# Altium project W5500-2.PrjPcb
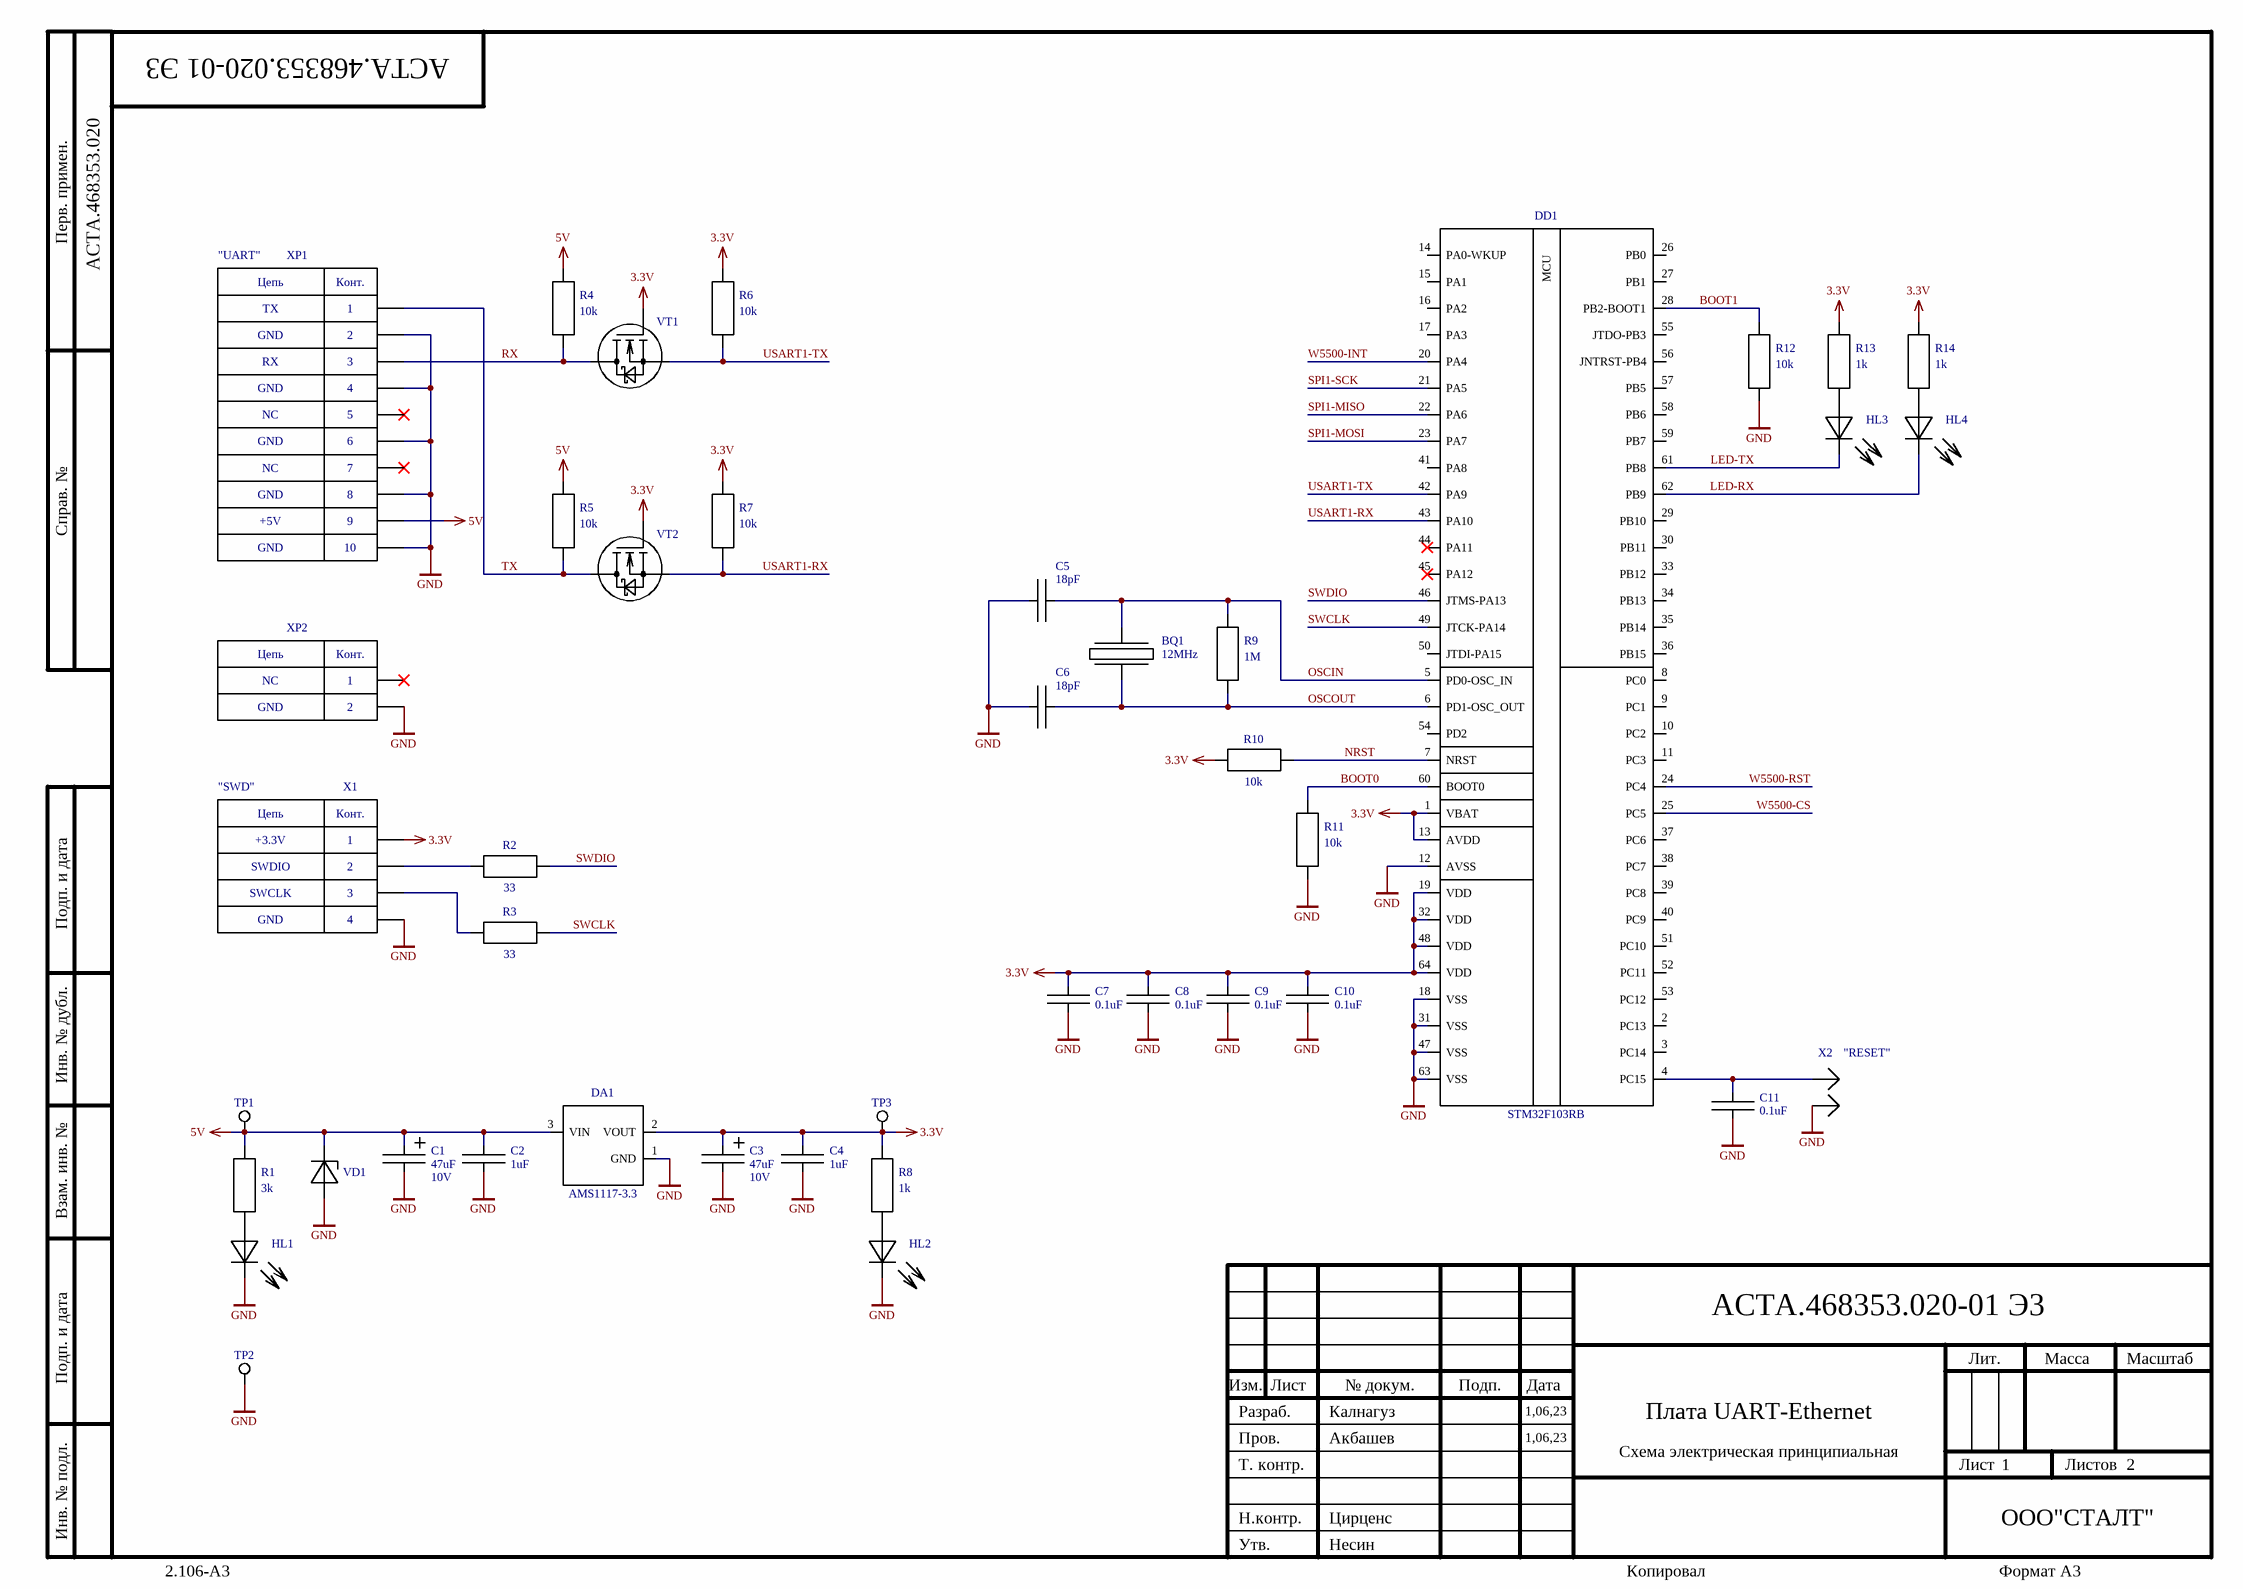
[diagram p0: Sheet1_MCU.SchDoc]
2 sheets, 78 parts. Net scope: global (net labels, ports and power ports of the same name join across sheets).
Board file: W5500-2_V1.PcbDoc
Sheets:
  Sheet1_MCU.SchDoc
  Sheet2_W5500.SchDoc

## Sheet Sheet1_MCU.SchDoc
size 420 x 297 mm; SheetNumber: 1; SheetTotal: 2; 2oboznachenieDocumenta: АСТА.468353.020-01 Э3; 1.2naimenovanieDocumenta: Схема электрическая принципиальная; 1.1.2naimenovanieIzdeliyaNiznyaya: Плата UART-Ethernet; 7poryadkoviiNomerLista: 1; 8obscheeKolichestvoListov: 2; 9naimenovanieOrganizacii: ООО"СТАЛТ"; 25pervichnoePrimenenie: АСТА.468353.020; 11.1familiyaRazrabotchika: Калнагуз; 11.2familiyaProveryauschego: Акбашев; 11.5familiyaNormKontrolya: Цирценс; 11.6familiyaUtverzhdauschego: Несин; 13.1dataPodpisiRazrabotchika: 1,06,23; 13.2dataPodpisiProveryauschego: 1,06,23

### Parts
BQ1  value 12MHz  [HT-49S]  (hidden comment: HT-49S_Rated)
C1  value 47uF  Voltage: 10V  [CaseB_TantalumCap]  (hidden comment: CaseB_TantalumCap)
C2  value 1uF  [CAP0805]  (hidden comment: CAP0805_Rated)
C3  value 47uF  Voltage: 10V  [CaseB_TantalumCap]  (hidden comment: CaseB_TantalumCap)
C4  value 1uF  [CAP0805]  (hidden comment: CAP0805_Rated)
C5  value 18pF  [CAP0805]  (hidden comment: CAP0805_Rated)
C6  value 18pF  [CAP0805]  (hidden comment: CAP0805_Rated)
C7  value 0.1uF  [CAP0805]  (hidden comment: CAP0805_Rated)
C8  value 0.1uF  [CAP0805]  (hidden comment: CAP0805_Rated)
C9  value 0.1uF  [CAP0805]  (hidden comment: CAP0805_Rated)
C10  value 0.1uF  [CAP0805]  (hidden comment: CAP0805_Rated)
C11  value 0.1uF  [CAP0805]  (hidden comment: CAP0805_Rated)
DA1  AMS1117-3.3  [SOT-223]
DD1  STM32F103RB  [LQFP-64]
HL1  KPTD-3216MGC  [KPTD-3216 Green]  (value not drawn)
HL2  KPTD-3216MGC  [KPTD-3216 Green]  (value not drawn)
HL3  KPTD-3216MGC  [KPTD-3216 Green]  (value not drawn)
HL4  KPTD-3216SYC  [KPTD-3216 Yellow]  (value not drawn)
R1  value 3k  [RES0805]  (hidden comment: RES0805_Rated)
R2  value 33  [RES0805]  (hidden comment: RES0805_Rated)
R3  value 33  [RES0805]  (hidden comment: RES0805_Rated)
R4  value 10k  [RES0805]  (hidden comment: RES0805_Rated)
R5  value 10k  [RES0805]  (hidden comment: RES0805_Rated)
R6  value 10k  [RES0805]  (hidden comment: RES0805_Rated)
R7  value 10k  [RES0805]  (hidden comment: RES0805_Rated)
R8  value 1k  [RES0805]  (hidden comment: RES0805_Rated)
R9  value 1M  [RES0805]  (hidden comment: RES0805_Rated)
R10  value 10k  [RES0805]  (hidden comment: RES0805_Rated)
R11  value 10k  [RES0805]  (hidden comment: RES0805_Rated)
R12  value 10k  [RES0805]  (hidden comment: RES0805_Rated)
R13  value 1k  [RES0805]  (hidden comment: RES0805_Rated)
R14  value 1k  [RES0805]  (hidden comment: RES0805_Rated)
TP1  TestPad  [PAD-TH-OCT1x1-0.5]  (value not drawn)  (no BOM)
TP2  TestPad  [PAD-TH-OCT1x1-0.5]  (value not drawn)  (no BOM)
TP3  TestPad  [PAD-TH-OCT1x1-0.5]  (value not drawn)  (no BOM)
VD1  SMAJ5.0A  [SMA (DO-214AC)]  (value not drawn)
VT1  BSS138  [SOT-23]  (value not drawn)
VT2  BSS138  [SOT-23]  (value not drawn)
X1  Circuit4: GND  Circuit3: SWCLK  Circuit1: +3.3V  Circuit2: SWDIO  Label: "SWD"  [PBS-4]  (hidden comment: PBS-4)
X2  Label: "RESET"  [PLS-2]  (hidden comment: PLS-2)
XP1  Circuit4: GND  Circuit5: NC  Circuit9: +5V  Circuit3: RX  Circuit1: TX  Label: "UART"  [PLS-10]  (hidden comment: PLS-10)
XP2  Circuit1: NC  Circuit2: GND  [PLS-2]  (hidden comment: PLS-2)

### Nets
3.3V: C3.1(+) C4.1 C7.1 C8.1 C9.1 C10.1 DA1.2(VOUT) DD1.1(VBAT) DD1.13(AVDD) DD1.19(VDD) DD1.32(VDD) DD1.48(VDD) DD1.64(VDD) R6.2 R7.2 R8.2 R10.1 R13.2 R14.2 TP3.1 VT1.1(G) VT2.1(G) X1.1
5V: C1.1(+) C2.1 DA1.3(VIN) R1.2 R4.2 R5.2 TP1.1 VD1.K XP1.9
GND: C1.2(-) C2.2 C3.2(-) C4.2 C5.1 C6.1 C7.2 C8.2 C9.2 C10.2 C11.2 DA1.1(GND) DD1.12(AVSS) DD1.18(VSS) DD1.31(VSS) DD1.47(VSS) DD1.63(VSS) HL1.K HL2.K R11.1 R12.1 TP2.1 VD1.A X1.4 X2.2 XP1.2 XP1.4 XP1.6 XP1.8 XP1.10 XP2.2
BOOT0: DD1.60(BOOT0) R11.2
BOOT1: DD1.28(PB2-BOOT1) R12.2
LED-RX: DD1.62(PB9) HL4.K
LED-TX: DD1.61(PB8) HL3.K
NRST: DD1.7(NRST) R10.2
OSCIN: BQ1.1 C5.2 DD1.5(PD0-OSC_IN) R9.2
OSCOUT: BQ1.2 C6.2 DD1.6(PD1-OSC_OUT) R9.1
RX: R4.1 VT1.2(D) XP1.3
SPI1-MISO: DD1.22(PA6)
SPI1-MOSI: DD1.23(PA7)
SPI1-SCK: DD1.21(PA5)
SWCLK: DD1.49(JTCK-PA14) R3.2
SWDIO: DD1.46(JTMS-PA13) R2.2
TX: R5.1 VT2.2(D) XP1.1
USART1-RX: DD1.43(PA10) R7.1 VT2.3(S)
USART1-TX: DD1.42(PA9) R6.1 VT1.3(S)
W5500-CS: DD1.25(PC5)
W5500-INT: DD1.20(PA4)
W5500-RST: DD1.24(PC4)
NetC11_1: C11.1 DD1.4(PC15) X2.1
NetHL1_A: HL1.A R1.1
NetHL2_A: HL2.A R8.1
NetHL3_A: HL3.A R13.1
NetHL4_A: HL4.A R14.1
NetR2_1: R2.1 X1.2
NetR3_1: R3.1 X1.3

Not connected (* = marked no-connect by the designer): DD1 2(PC13) 3(PC14) 8(PC0) 9(PC1) 10(PC2) 11(PC3) 14(PA0-WKUP) 15(PA1) 16(PA2) 17(PA3) 26(PB0) 27(PB1) 29(PB10) 30(PB11) 33(PB12) 34(PB13) 35(PB14) 36(PB15) 37(PC6) 38(PC7) 39(PC8) 40(PC9) 41(PA8) 44(PA11)* 45(PA12)* 50(JTDI-PA15) 51(PC10) 52(PC11) 53(PC12) 54(PD2) 55(JTDO-PB3) 56(JNTRST-PB4) 57(PB5) 58(PB6) 59(PB7); XP1 5* 7*; XP2 1*

### Notes on the sheet
- Перв. примен.
- Справ. №
- Подп. и дата
- Инв. № дубл.
- Взам. инв. №
- Разраб.
- Изм.
- Лист
- № докум.
- Подп.
- Дата
- Лит.
- Масса
- Масштаб
- Пров.
- Т. контр.
- Листов
- Инв. № подл.
- Н.контр.
- Утв.
- 2.106-A3
- Копировал
- Формат А3
- (in symbol PBS-4) Цепь; Конт.
- (in symbol PLS-2) Цепь; Конт.
- (in symbol PLS-10) Цепь; Конт.
- (in symbol STM32F103RB) MCU

### Library data of the parts
DA1 = AMS1117-3.3: Fixed Voltage 3.3V 1A Low Dropout Voltage Regulator
DD1 = STM32F103RB: ARM Cortex-M3 MCU
HL1-HL3 = KPTD-3216MGC: 3.2x1.6mm SMD LED Mega Green
HL4 = KPTD-3216SYC: 3.2x1.6mm SMD LED Super Bright Yellow
R1-R14 = RES0805_Rated: Tolerance: 5%; 1Ccode: *; 1Cname: *; 1CfullName: *; 1Cgroup: *; 1Carticle: *; Name: *; Manufacturer: *; PartNumber: *; DatasheetLink: *; Case: *
TP1-TP3 = TestPad: TestPoint on PCB; Label: "Label"
VD1 = SMAJ5.0A: 5Vr 400W 43.5A UniDirectional TVS; Vbr: 6.4V
VT1 VT2 = BSS138: Small Signal N-Channel MOSFET 50V 220mA; pin to pad: 2>3 3>2; 1Ccode: М00041810; 1Cname: Транзистор BSS138; 1Cgroup: 01010104; 1Carticle: 30894; 1CfullName: Транзистор BSS138; Name: Транзистор BSS138; PartNumber: BSS138; Case: SOT-23; ComponentLink1Description: DatasheetLink; ComponentLink1URL: *; ChannelPolarity: N-Channel
X1 = PBS-4: Female Header Pitch 2.54mm; 1Ccode: *; 1Cname: *; 1CfullName: *; 1Cgroup: *; 1Carticle: *; Manufacturer: *; Name: *; PartNumber: *; ComponentLink1Description: DatasheetLink; ComponentLink1URL: *
X2 = PLS-2: Pin Header Pitch 2.54mm; Circuit1: *1; Circuit2: *2
XP1 = PLS-10: Pin Header Pitch 2.54mm; Circuit6: GND; Circuit7: NC; Circuit8: GND; Circuit10: GND; Circuit2: GND
XP2 = PLS-2: Pin Header Pitch 2.54mm; Label: "Label"
BQ1 = HT-49S_Rated: 1Ccode: *; 1Cname: *; 1CfullName: *; 1Cgroup: *; 1Carticle: *; Manufacturer: *; Name: *; PartNumber: *; Case: *; Tolerance: *; ComponentLink1Description: DatasheetLink; ComponentLink1URL: *; Frequency: *
C2 C4-C11 = CAP0805_Rated: 1Ccode: *; 1Cname: *; 1CfullName: *; 1Cgroup: *; 1Carticle: *; Manufacturer: *; Name: *; PartNumber: *; ComponentLink1Description: DatasheetLink; ComponentLink1URL: *; Case: 0805; Tolerance: *; RatedVoltage: *; TemperatureCharacteristic: *

## Sheet Sheet2_W5500.SchDoc
size 420 x 297 mm; SheetNumber: 2; SheetTotal: 2; 2oboznachenieDocumenta: АСТА.468353.020-01 Э3; 1.2naimenovanieDocumenta: Схема электрическая принципиальная; 7poryadkoviiNomerLista: 2; 8obscheeKolichestvoListov: 2; 13.1dataPodpisiRazrabotchika: 22.02.23
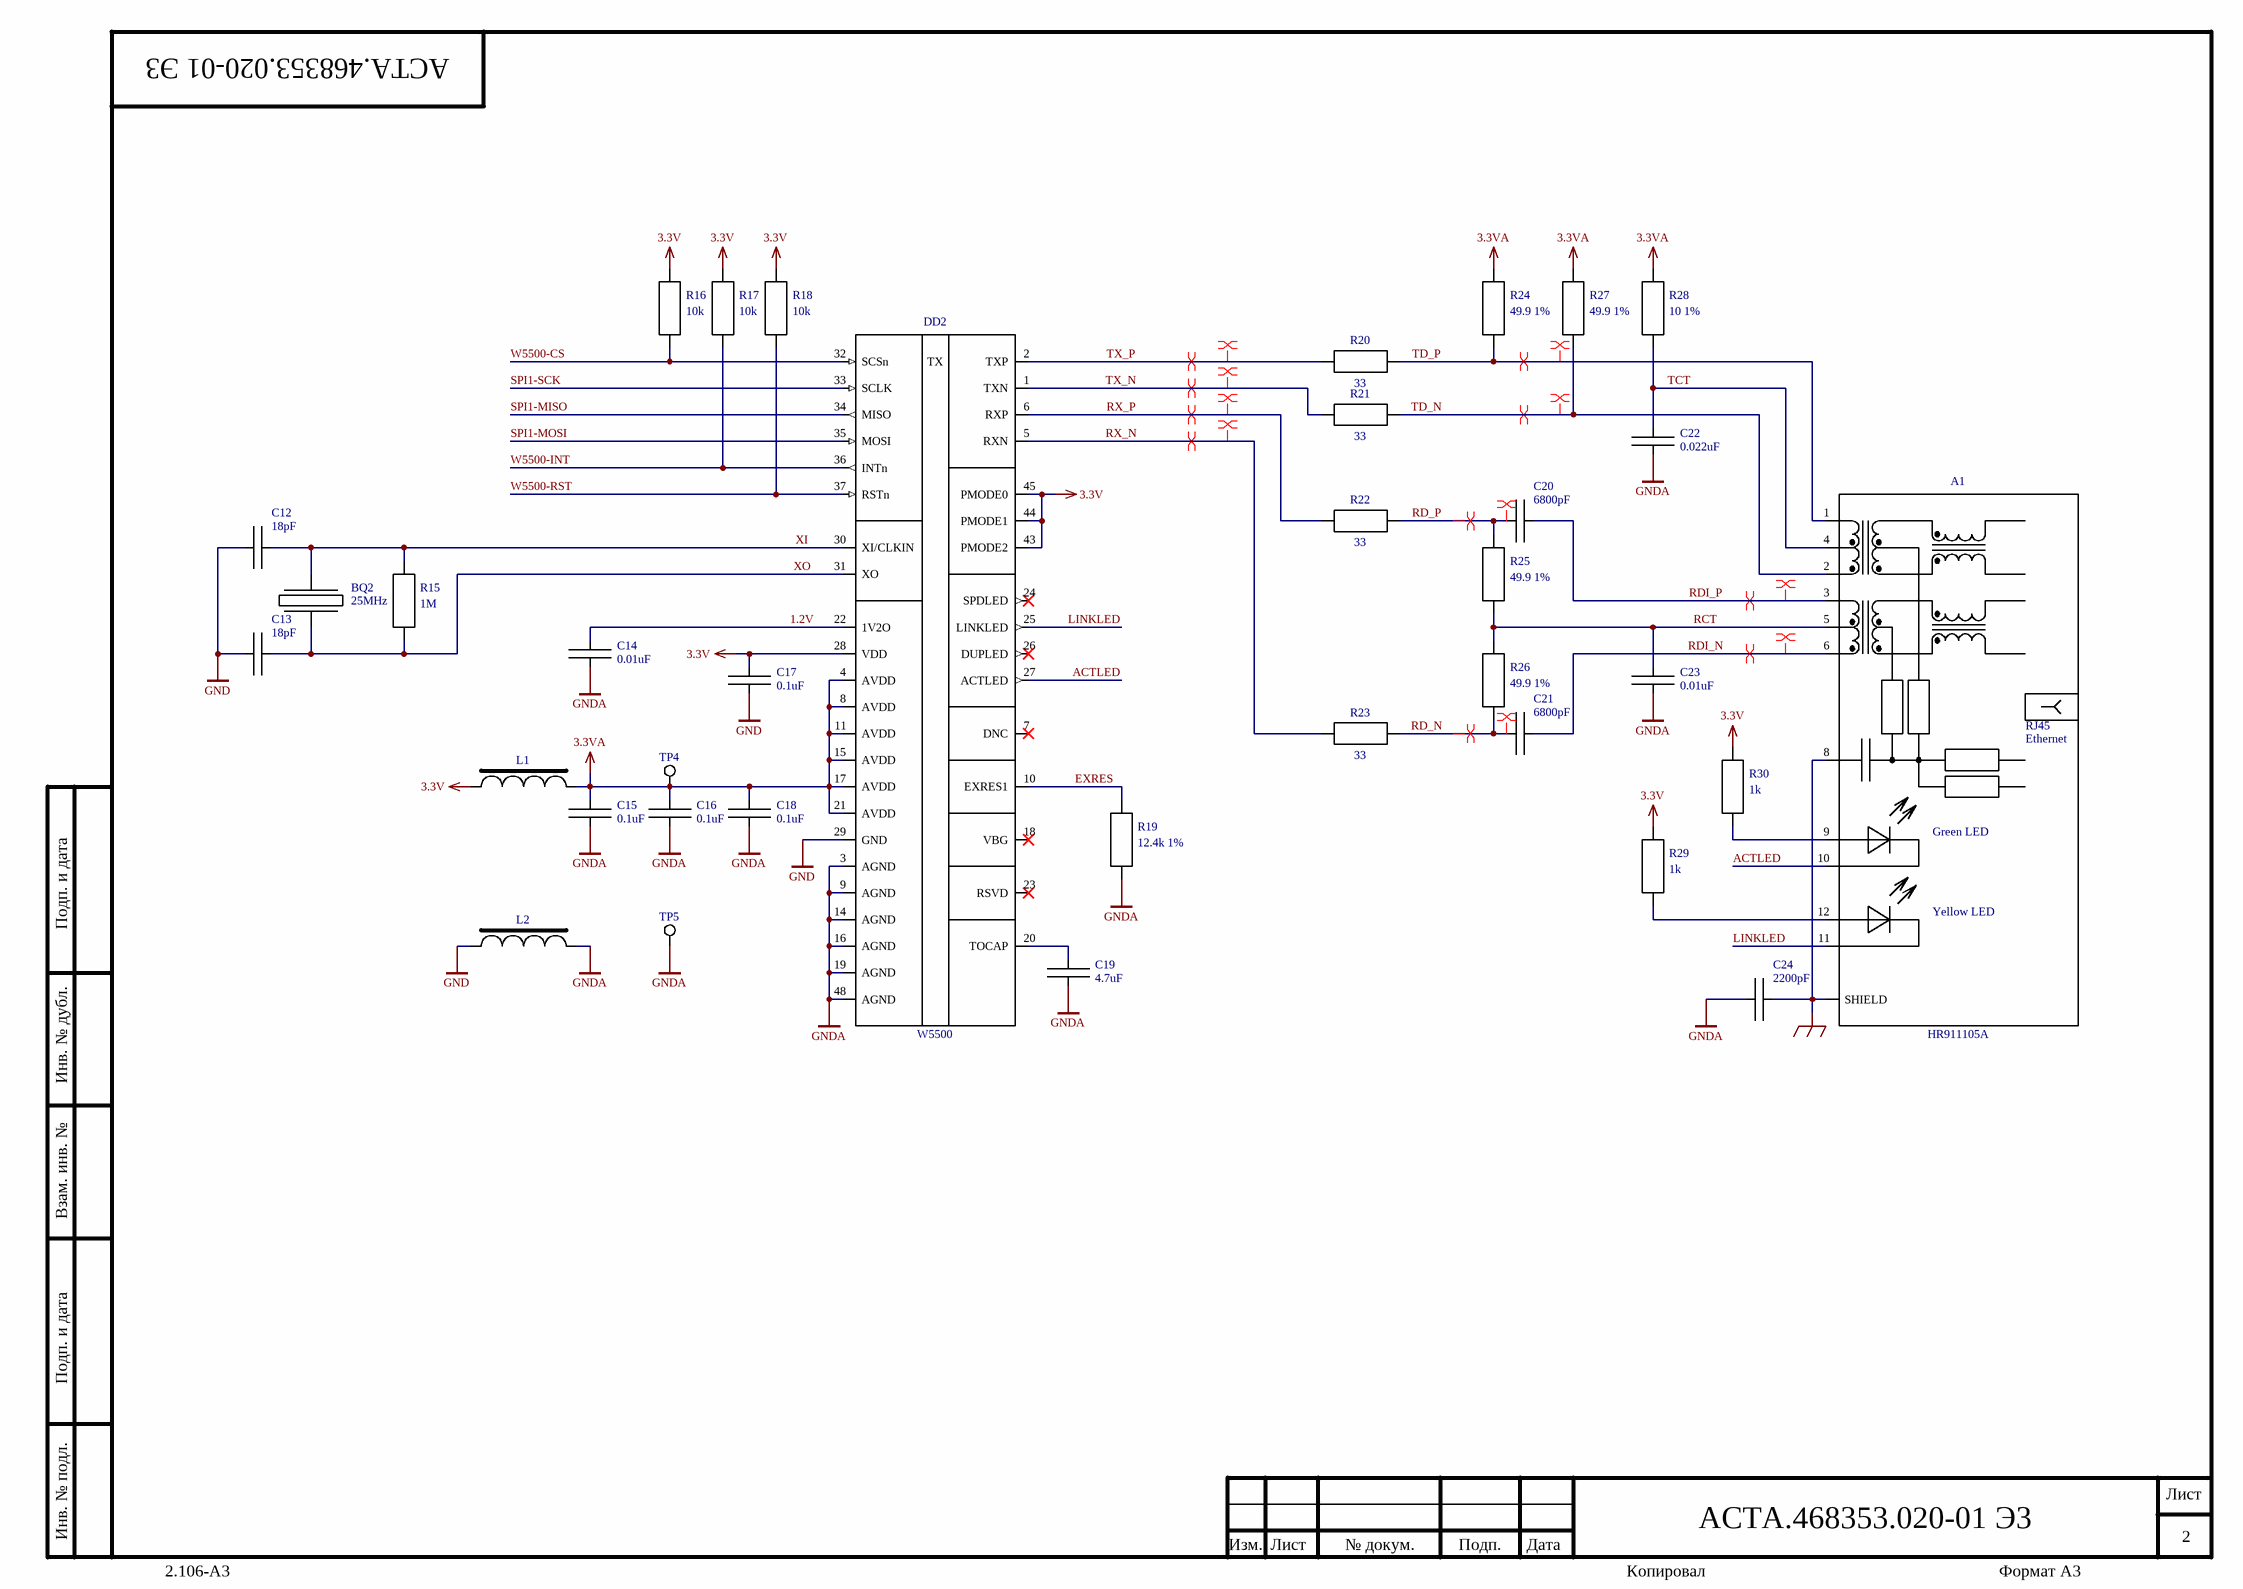
[diagram p1: Sheet2_W5500.SchDoc]

### Parts
A1  HR911105A  [HR911105A]
BQ2  value 25MHz  [HT-49S]  (hidden comment: HT-49S_Rated)
C12  value 18pF  [CAP0805]  (hidden comment: CAP0805_Rated)
C13  value 18pF  [CAP0805]  (hidden comment: CAP0805_Rated)
C14  value 0.01uF  [CAP0805]  (hidden comment: CAP0805_Rated)
C15  value 0.1uF  [CAP0805]  (hidden comment: CAP0805_Rated)
C16  value 0.1uF  [CAP0805]  (hidden comment: CAP0805_Rated)
C17  value 0.1uF  [CAP0805]  (hidden comment: CAP0805_Rated)
C18  value 0.1uF  [CAP0805]  (hidden comment: CAP0805_Rated)
C19  value 4.7uF  [CAP1206]  (hidden comment: CAP1206_Rated)
C20  value 6800pF  [CAP0805]  (hidden comment: CAP0805_Rated)
C21  value 6800pF  [CAP0805]  (hidden comment: CAP0805_Rated)
C22  value 0.022uF  [CAP0805]  (hidden comment: CAP0805_Rated)
C23  value 0.01uF  [CAP0805]  (hidden comment: CAP0805_Rated)
C24  value 2200pF  [CAP1812]  (hidden comment: CAP1812_Rated)
DD2  W5500  [LQFP-48]
L1  BLM21BD121SN1D  [IND0805]  (value not drawn)
L2  BLM21BD121SN1D  [IND0805]  (value not drawn)
R15  value 1M  [RES0805]  (hidden comment: RES0805_Rated)
R16  value 10k  [RES0805]  (hidden comment: RES0805_Rated)
R17  value 10k  [RES0805]  (hidden comment: RES0805_Rated)
R18  value 10k  [RES0805]  (hidden comment: RES0805_Rated)
R19  value 12.4k 1%  [RES0805]  (hidden comment: RES0805_Rated)
R20  value 33  [RES0805]  (hidden comment: RES0805_Rated)
R21  value 33  [RES0805]  (hidden comment: RES0805_Rated)
R22  value 33  [RES0805]  (hidden comment: RES0805_Rated)
R23  value 33  [RES0805]  (hidden comment: RES0805_Rated)
R24  value 49.9 1%  [RES0805]  (hidden comment: RES0805_Rated)
R25  value 49.9 1%  [RES0805]  (hidden comment: RES0805_Rated)
R26  value 49.9 1%  [RES0805]  (hidden comment: RES0805_Rated)
R27  value 49.9 1%  [RES0805]  (hidden comment: RES0805_Rated)
R28  value 10 1%  [RES0805]  (hidden comment: RES0805_Rated)
R29  value 1k  [RES0805]  (hidden comment: RES0805_Rated)
R30  value 1k  [RES0805]  (hidden comment: RES0805_Rated)
TP4  TestPad  [PAD-TH-OCT1x1-0.5]  (value not drawn)  (no BOM)
TP5  TestPad  [PAD-TH-OCT1x1-0.5]  (value not drawn)  (no BOM)

### Nets
3.3V: C17.1 DD2.28(VDD) DD2.43(PMODE2) DD2.44(PMODE1) DD2.45(PMODE0) L1.1 R16.2 R17.2 R18.2 R29.2 R30.2
3.3VA: C15.1 C16.1 C18.1 DD2.4(AVDD) DD2.8(AVDD) DD2.11(AVDD) DD2.15(AVDD) DD2.17(AVDD) DD2.21(AVDD) L1.2 R24.2 R27.2 R28.2 TP4.1
EARTH: A1.8(GND) A1.SHIELD C24.2
GND: C12.1 C13.1 C17.2 DD2.29(GND) L2.1
GNDA: C14.2 C15.2 C16.2 C18.2 C19.2 C22.2 C23.2 C24.1 DD2.3(AGND) DD2.9(AGND) DD2.14(AGND) DD2.16(AGND) DD2.19(AGND) DD2.48(AGND) L2.2 R19.1 TP5.1
1.2V: C14.1 DD2.22(1V2O)
ACTLED: A1.10(LED1-K) DD2.27(ACTLED)
EXRES: DD2.10(EXRES1) R19.2
LINKLED: A1.11(LED2-A) DD2.25(LINKLED)
RCT: A1.5(CT) C23.1 R25.1 R26.2
RD_N: C21.1 R23.2 R26.1
RD_P: C20.1 R22.2 R25.2
RDI_N: A1.6(RD-) C21.2
RDI_P: A1.3(RD+) C20.2
RX_N: DD2.5(RXN) R23.1
RX_P: DD2.6(RXP) R22.1
SPI1-MISO: DD2.34(MISO)
SPI1-MOSI: DD2.35(MOSI)
SPI1-SCK: DD2.33(SCLK)
TCT: A1.4(CT) C22.1 R28.1
TD_N: A1.2(TD-) R21.2 R27.1
TD_P: A1.1(TD+) R20.2 R24.1
TX_N: DD2.1(TXN) R21.1
TX_P: DD2.2(TXP) R20.1
W5500-CS: DD2.32(SCSn) R16.1
W5500-INT: DD2.36(INTn) R17.1
W5500-RST: DD2.37(RSTn) R18.1
XI: BQ2.1 C12.2 DD2.30(XI/CLKIN) R15.2
XO: BQ2.2 C13.2 DD2.31(XO) R15.1
NetA1_9: A1.9(LED1-A) R30.1
NetA1_12: A1.12(LED2-K) R29.1
NetC19_1: C19.1 DD2.20(TOCAP)

Not connected (* = marked no-connect by the designer): DD2 7(DNC)* 18(VBG)* 23(RSVD)* 24(SPDLED)* 26(DUPLED)*

### Layout directives
differential pair: RD_N, RD_P, RDI_N, RDI_P, RX_N, RX_P, TD_N, TD_P, TX_N, TX_P
net class ETHERNET: RD_N, RD_P, RDI_N, RDI_P, RX_N, RX_P, TD_N, TD_P, TX_N, TX_P

### Notes on the sheet
- Подп. и дата
- Инв. № дубл.
- Взам. инв. №
- Инв. № подл.
- Изм.
- Лист
- № докум.
- Подп.
- Дата
- 2.106-A3
- Копировал
- Формат А3
- (in symbol HR911105A) RJ45; Ethernet; Green LED; Yellow LED
- (in symbol W5500) TX

### Library data of the parts
A1 = HR911105A: Ethernet Connector 10/100 1x1 Tab Down RJ45 w/mag G/Y LED
DD2 = W5500: Ethernet ICs 3in1 Enet Controller TCP/IP +MAC+PHY
L1 L2 = BLM21BD121SN1D: Ferrite Bead 0805 120 Ohm; Manufacturer: Murata; Value: 120 Ohm; 1Ccode: М00053470; 1Cname: BLM21BD121SN1D MUR; 1Cgroup: 01010901; 1Carticle: 42076; Name: Фильтр BLM21BD121SN1D; Tolerance: 25%; RatedCurrent: 200mA; DCResistance: 0.25 Ohm; 1CfullName: BLM21BD121SN1D MUR; PartNumber: BLM21BD121SN1D; ComponentLink1Description: DatasheetLink; ComponentLink1URL: *; Case: 0805
R15-R30 = RES0805_Rated: Tolerance: 5%; 1Ccode: *; 1Cname: *; 1CfullName: *; 1Cgroup: *; 1Carticle: *; Name: *; Manufacturer: *; PartNumber: *; DatasheetLink: *; Case: *
TP4 TP5 = TestPad: TestPoint on PCB; Label: "Label"
BQ2 = HT-49S_Rated: 1Ccode: *; 1Cname: *; 1CfullName: *; 1Cgroup: *; 1Carticle: *; Manufacturer: *; Name: *; PartNumber: *; Case: *; Tolerance: *; ComponentLink1Description: DatasheetLink; ComponentLink1URL: *; Frequency: *
C12-C18 C20-C23 = CAP0805_Rated: 1Ccode: *; 1Cname: *; 1CfullName: *; 1Cgroup: *; 1Carticle: *; Manufacturer: *; Name: *; PartNumber: *; ComponentLink1Description: DatasheetLink; ComponentLink1URL: *; Case: 0805; Tolerance: *; RatedVoltage: *; TemperatureCharacteristic: *
C19 = CAP1206_Rated: 1Ccode: *; 1Cname: *; 1CfullName: *; 1Cgroup: *; 1Carticle: *; Manufacturer: *; Name: *; PartNumber: *; ComponentLink1Description: DatasheetLink; ComponentLink1URL: *; Case: 1206; Tolerance: *; RatedVoltage: *; TemperatureCharacteristic: *
C24 = CAP1812_Rated: 1Ccode: *; 1Cname: *; 1CfullName: *; 1Cgroup: *; 1Carticle: *; Manufacturer: *; Name: *; PartNumber: *; ComponentLink1Description: DatasheetLink; ComponentLink1URL: *; Case: 1812; Tolerance: *; RatedVoltage: *; TemperatureCharacteristic: *

## Nets that join several sheets
3.3V: Sheet1_MCU (23 pins), Sheet2_W5500 (11 pins)
GND: Sheet1_MCU (31 pins), Sheet2_W5500 (5 pins)
SPI1-MISO: Sheet1_MCU (DD1.22), Sheet2_W5500 (DD2.34)
SPI1-MOSI: Sheet1_MCU (DD1.23), Sheet2_W5500 (DD2.35)
SPI1-SCK: Sheet1_MCU (DD1.21), Sheet2_W5500 (DD2.33)
W5500-CS: Sheet1_MCU (DD1.25), Sheet2_W5500 (DD2.32 R16.1)
W5500-INT: Sheet1_MCU (DD1.20), Sheet2_W5500 (DD2.36 R17.1)
W5500-RST: Sheet1_MCU (DD1.24), Sheet2_W5500 (DD2.37 R18.1)